# EAGLE design Voltmeter PCB RTC_f (EAGLE 9.6.2)
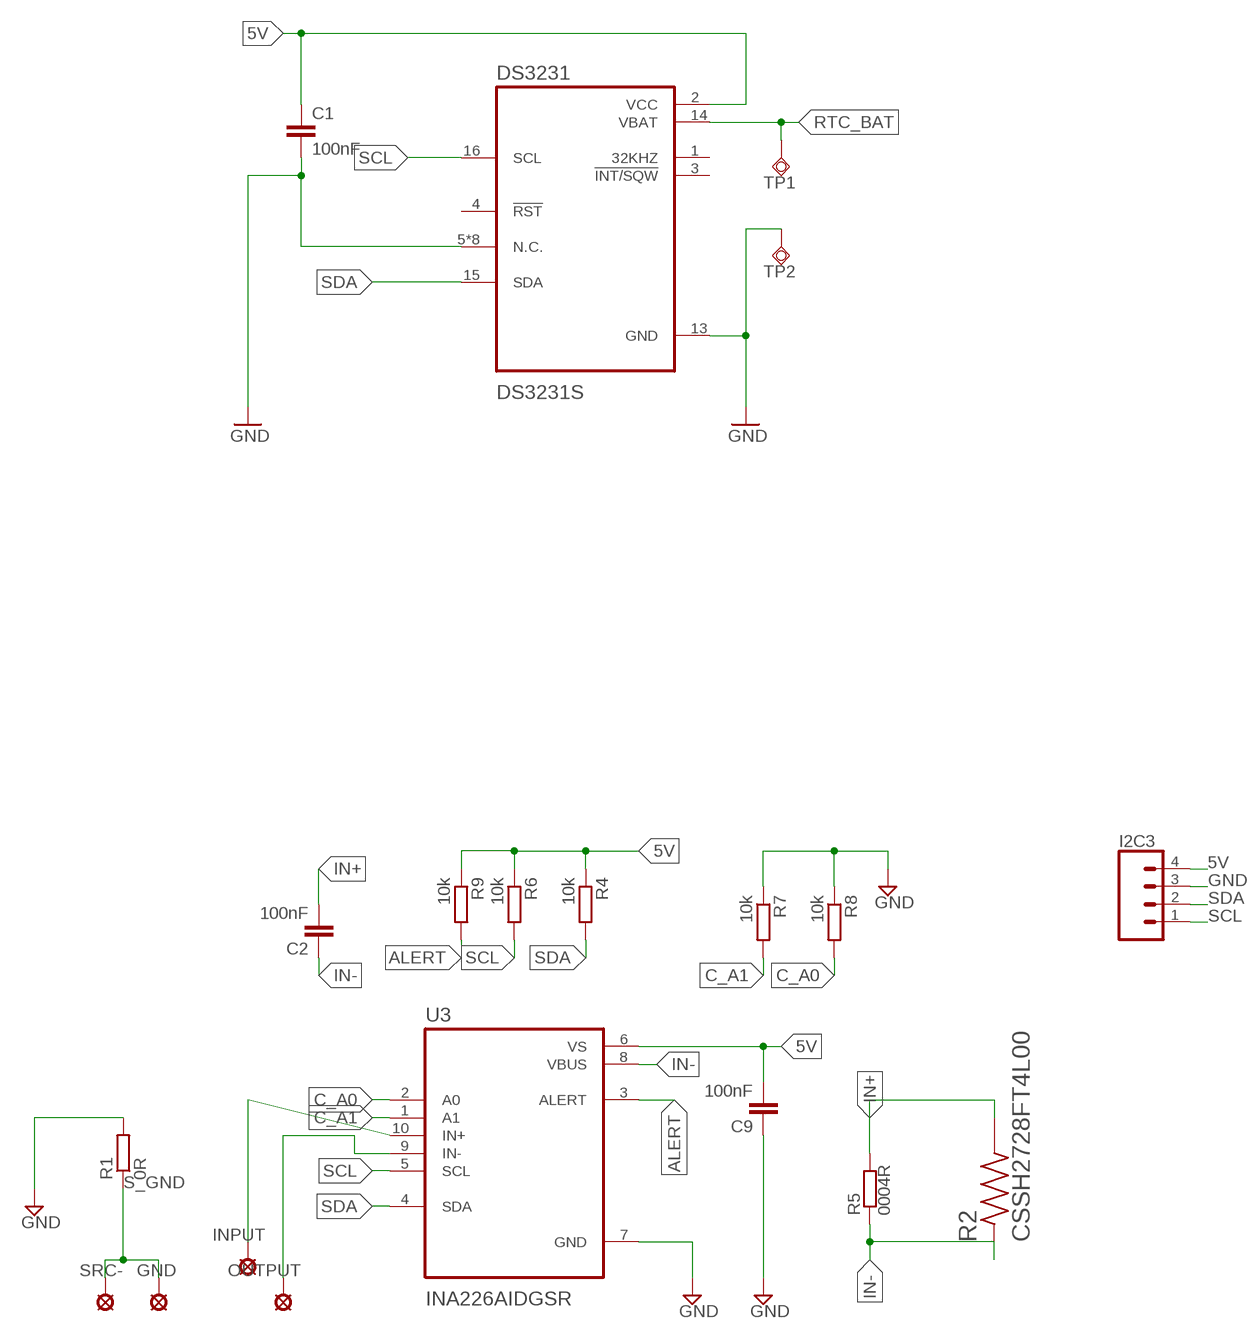
[diagram p0: schematic, sheet 1]

## Parts
C1  100nF  C-EUC0603  [C0603]
C2  100nF  C-EUC0603  [C0603]
C9  100nF  C-EUC0603  [C0603]
DS3231  DS3231S  [SOIC127P1032X265-16N]
GND  SE14  [SE14]
I2C3  CONN_041X04_NO_SILK  [1X04_NO_SILK]
INPUT  SE14  [SE14]
OUTPUT  SE14  [SE14]
R1  0R  R-EU_R1206  [R1206]
R2  CSSH2728FT4L00  [RESC6771X124N]
R4  10k  R-EU_R0603  [R0603]
R5  0004R  BVS  [BVS]
R6  10k  R-EU_R0603  [R0603]
R7  10k  R-EU_R0603  [R0603]
R8  10k  R-EU_R0603  [R0603]
R9  10k  R-EU_R0603  [R0603]
SRC-  SE14  [SE14]
TP1  TPSQB1,27  [B1,27]
TP2  TPSQB1,27  [B1,27]
U3  INA226AIDGSR  [SOP50P490X110-10N]

## Nets
5V: C1.1 C9.2 DS3231.2(VCC) I2C3.4 R4.1 R6.1 R9.1 U3.6(VS)
ALERT: R9.2 U3.3(ALERT)
C_A0: R8.2 U3.2(A0)
C_A1: R7.2 U3.1(A1)
GND: C1.2 C9.1 DS3231.5(N.C.) DS3231.6(N.C.) DS3231.7(N.C.) DS3231.8(N.C.) DS3231.9(N.C.) DS3231.10(N.C.) DS3231.11(N.C.) DS3231.12(N.C.) DS3231.13(GND) I2C3.3 R1.2 R7.1 R8.1 TP2.TP U3.7(GND)
IN+: C2.2 OUTPUT.MP R2.2 R5.1 U3.9(IN-)
IN-: C2.1 INPUT.MP R2.1 R5.2 U3.8(VBUS) U3.10(IN+)
RTC_BAT [medium]: DS3231.14(VBAT) TP1.TP
S_GND [high_current]: GND.MP R1.1 SRC-.MP
SCL: DS3231.16(SCL) I2C3.1 R6.2 U3.5(SCL)
SDA: DS3231.15(SDA) I2C3.2 R4.2 U3.4(SDA)
Unconnected: DS3231.1(32KHZ) DS3231.3(!INT/SQW) DS3231.4(!RST)

## Library data of the parts
C1 = resistor:C-EU: CAPACITOR, European symbol
C2 C9 = rcl:C-EU: CAPACITOR, European symbol; SPICEPREFIX: C
DS3231 = DS3231S:DS3231S: Check prices <https://pricing.snapeda.com/parts/DS3231S/Maxim%20Integrated/view-part?ref=eda>; AVAILABILITY: Warning; DESCRIPTION: Real Time Clock (RTC) IC Clock/Calendar I²C, 2-Wire Serial 16-SOIC (0.295, 7.50mm Width); MF: Maxim Integrated; MP: DS3231S; PACKAGE: SOIC-16 Maxim Integrated; PRICE: None; PURCHASE-URL: https://pricing.snapeda.com/search/part/DS3231S/?ref=eda
GND INPUT OUTPUT SRC- = solpad:SE14: SOLDER PAD E1553, drill 1,4mm, distributor Buerklin, 07F820
I2C3 = SparkFun-Connectors:CONN_04: Multi connection point. Often used as Generic Header-pin footprint for 0.1 inch spaced/style header connections On any of the 0.1 inch spaced packages, you can populate with these: Break Away Headers - Straight <https://www.sparkfun.com/products/116> (PRT-00116) Break Away Male Headers - Right Angle <https://www.sparkfun.com/products/553> (PRT-00553) Female Headers <https://www.sparkfun.com/products/115> (PRT-00115) Break Away Headers - Machine Pin <https://www.sparkfun.com/products/117> (PRT-00117) Break Away Female Headers - Swiss Machine Pin <https://www.sparkfun.com/products/743> (PRT-00743) For SCREWTERMINALS and SPRING TERMINALS visit here: Screw Terimnals on SparkFun.com <https://www.sparkfun.com/search/results?term=Screw+Terminals> (5mm/3.5mm/2.54mm spacing) This device is also useful as a general connection point to wire up your design to another part of your project. Our various solder wires solder well into these plated through hole pads. Hook-Up Wire - Assortment (Stranded, 22 AWG) <https://www.sparkfun.com/products/11375> (PRT-11375) Hook-Up Wire - Assortment (Solid Core, 22 AWG) <https://www.sparkfun.com/products/11367> (PRT-11367) View the entire wire category on our website here <https://www.sparkfun.com/categories/141> Special notes: Molex polarized connector foot print use with SKU : PRT-08231 with associated crimp pins and housings. 1MM SMD Version SKU: PRT-10208; PROD_ID: CONN-09696
R1 R4 R6-R9 = rcl:R-EU_: RESISTOR, European symbol; SPICEPREFIX: R
R2 = CSSH2728FT4L00:CSSH2728FT4L00: Check availability <https://pricing.snapeda.com/parts/CSSH2728FT4L00/Stackpole%20Electronics%20Inc/view-part?ref=eda>; AVAILABILITY: In Stock; CHECK_PRICES: https://www.snapeda.com/parts/CSSH2728FT4L00/Stackpole+Electronics/view-part/?ref=eda; DESCRIPTION: 4 mOhms ±1% 4W Chip Resistor Wide 2827 (7067 Metric), 2728 Automotive AEC-Q200, Current Sense Metal Element; MF: Stackpole Electronics Inc; MP: CSSH2728FT4L00; PACKAGE: 6771 Stackpole; PRICE: None; SNAPEDA_LINK: https://www.snapeda.com/parts/CSSH2728FT4L00/Stackpole+Electronics/view-part/?ref=snap
R5 = resistor-shunt:BVS: SMD SHUNT RESISTOR; OC_FARNELL: unknown; OC_NEWARK: unknown
TP1 TP2 = testpad:TPSQ: Test pad
U3 = INA226AIDGSR:INA226AIDGSR: Check availability <https://pricing.snapeda.com/parts/INA226AIDGSR/Texas%20Instruments/view-part?ref=eda>; AVAILABILITY: In Stock; CHECK_PRICES: https://www.snapeda.com/parts/INA226AIDGSR/Texas+Instruments/view-part/?ref=eda; DESCRIPTION: 36V, 16-bit, ultra-precise i2c output current/voltage/power monitor w/alert; MF: Texas Instruments; MP: INA226AIDGSR; PACKAGE: VSSOP-10 Texas Instruments; PRICE: None; SNAPEDA_LINK: https://www.snapeda.com/parts/INA226AIDGSR/Texas+Instruments/view-part/?ref=snap

## Net classes
0 default: width 0.305 mm, drill 0.254 mm, clearance 0.381 mm
1 high_current: width 3 mm, drill 0.508 mm, clearance 0.9 mm
2 medium: width 0.381 mm, drill 0.3 mm, clearance 0.381 mm

## Board
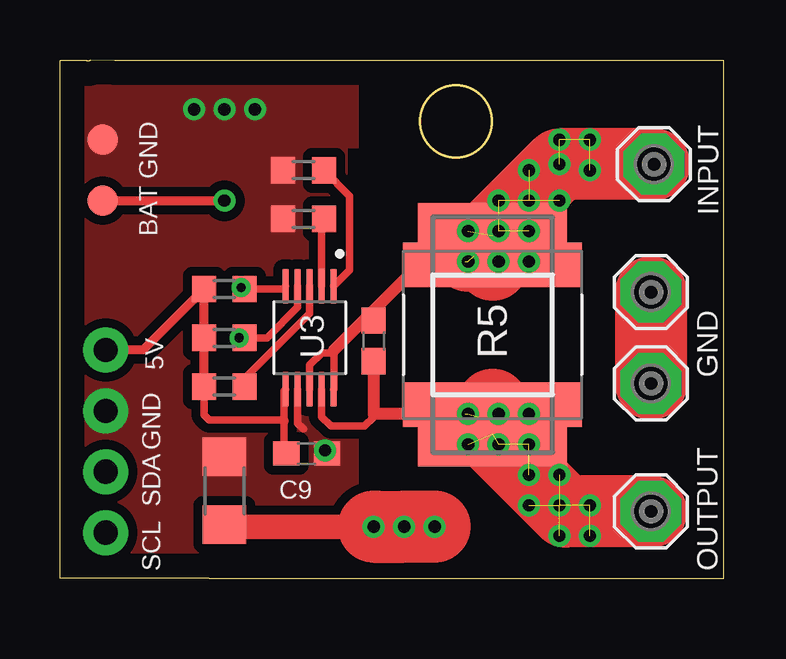
[diagram p1: board, top side]
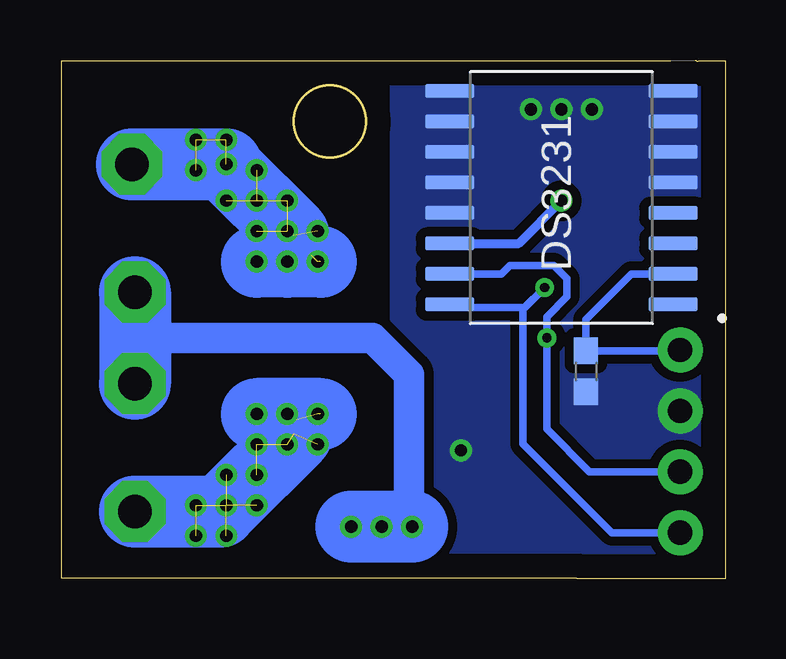
[diagram p2: board, bottom side, seen from below]

Size 27.69 x 21.62 mm. Coordinates in mm from the lower left corner, seen from the top.
Outline: 6.22,0 27.69,0 27.69,21.59 2.29,21.59 1.27,21.62 arc-100 1.11,21.59 0,21.59 0,0 6.16,0 arc-90 6.22,0
Outline: circle at 16.51,19.05 radius 1.5
Copper layers (1*16): Top 0.035mm / dielectric 1.5mm / Bottom 0.035mm
Design rules "default *": minimum track width 10mil, minimum drill 0.35mm, track to track 9mil, track to pad 9mil, pad to pad 6mil, via to via 6mil, smd to smd 6mil, copper to edge 40mil, drill to drill 6mil, minimum pad ring 10mil, minimum via ring 8mil, stop-mask expansion 4mil, vias tented up to drill 100mil, thermal gap 10mil

### Footprints (pad centres in the part's own frame; a part is rotated, then mirrored left to right if it is on the bottom)
C0603 = smd 1.1 x 1: 1 -0.85,0; 2 0.85,0
SOIC127P1032X265-16N = smd 2.05 x 0.59: 1 -4.655,4.445; 2 -4.655,3.175; 3 -4.655,1.905; 4 -4.655,0.635; 5 -4.655,-0.635; 6 -4.655,-1.905; 7 -4.655,-3.175; 8 -4.655,-4.445; 9 4.655,-4.445; 10 4.655,-3.175; 11 4.655,-1.905; 12 4.655,-0.635; 13 4.655,0.635; 14 4.655,1.905; 15 4.655,3.175; 16 4.655,4.445
SE14 = drill 1.397 pad 2.54 octagon: MP 0,0
1X04_NO_SILK = drill 1.016 pad 1.88: 1 0,0; 2 2.54,0; 3 5.08,0; 4 7.62,0
R1206 = smd 1.6 x 1.803: 1 -1.422,0; 2 1.422,0
RESC6771X124N = smd 1.84 x 7.45: 1 -2.916,0; 2 2.916,0
R0603 = smd 1 x 1.1: 1 -0.85,0; 2 0.85,0
BVS = smd 2.7 x 6.2: 1 -4.14,0; 2 4.14,0
B1,27 = smd 1.27 x 1.27: TP 0,0
SOP50P490X110-10N = smd 1.47 x 0.28: 1 -2.15,1; 2 -2.15,0.5; 3 -2.15,0; 4 -2.15,-0.5; 5 -2.15,-1; 6 2.15,-1; 7 2.15,-0.5; 8 2.15,0; 9 2.15,0.5; 10 2.15,1

### Placement (x,y rotation side)
C1  5.84,8.64 270 bottom
C2  13.08,9.91 270 top
C9  10.29,5.21 180 top
DS3231  6.86,15.88 180 bottom
GND  24.64,11.94 0 top
I2C3  1.9,1.91 90 top
INPUT  24.77,17.27 0 top
OUTPUT  24.64,2.79 0 top
R1  6.86,3.66 90 top
R2  18.03,10.16 270 top
R4  6.86,10.03 0 top
R5  18.03,10.16 90 top
R6  6.86,12.07 0 top
R7  10.16,17.02 0 top
R8  10.16,14.99 0 top
R9  6.86,8 0 top
SRC-  24.64,8.13 0 top
TP1  1.78,15.75 0 top
TP2  1.78,18.29 0 top
U3  10.41,10.03 270 top

### Tracks (layer width: path | path; a pad name or v marks a point on that pad's centre or on a via)
5V
  Top 0.305: 9.41,5.41 C9.2 | R9.1 6.01,6.82 6.22,6.6 9.35,6.6 | 9.38,6.57 9.35,6.6 | 9.41,5.53 9.41,5.23 C9.2 | 9.35,6.6 9.35,5.29 C9.2 | U3.6 9.35,7.82 9.35,6.6
  Top 0.381: I2C3.4 3.47,9.53 R6.1 R4.1 R9.1
  Bottom 0.305: DS3231.2 3.94,12.7 5.84,10.8 C1.1 1.94,9.49 I2C3.4
ALERT
  Top 0.305: U3.3 10.41,11.05 7.71,8.34 R9.2
C_A0
  Top 0.305: U3.2 10.91,14.89 R8.2
C_A1
  Top 0.305: R7.2 12.08,15.95 12.08,12.85 U3.1
GND  (via drill 0.51)
  Top 0.305: U3.7 9.91,6.47 10.16,6.22
  other vias: 11.05,5.33 6.86,19.56 8.13,19.56 5.59,19.56
  pour Top (no thermals): -5.84,30.99 11.94,30.99 11.94,-3.3 -5.84,-3.3
  pour Bottom (no thermals): 10.67,29.72 10.67,12.3 3.56,7.22 3.56,3.05 27.18,3.05 27.18,-43.94 -5.84,-43.94 -5.84,29.72
  pour Top (no thermals): -0.76,24.13 11.94,24.13 11.94,-5.84 -0.76,-5.84
  pour Bottom (no thermals): 13.97,32.26 13.97,-1.4 27.18,-1.4 27.18,-43.94 -4.57,-43.94 -4.57,32.26
IN+  (via drill 0.51)  (11 unrouted)
  Top 0.305: U3.9 10.91,6.74 11.3,6.35 12.7,6.35 13.06,6.72 13.06,8.13 | 13.06,8.13 13.06,9.25 12.95,9.14 | C2.2 13.08,8.14 13.06,8.13
  Top 0.508: v18.29,6.86 13.08,6.86 C2.2
  Top 3: OUTPUT.MP 21.08,2.79 18.03,5.84 R5.1 | R5.1 18.03,6.6 v18.29,6.86 | R2.2 R5.1
  Bottom 3: OUTPUT.MP 21.08,2.79 v20.83,3.05 17.91,5.97 17.91,6.62 | 16.89,6.86 v19.56,6.86
  other vias: 17.02,6.86 17.02,5.59 18.29,5.59 19.56,5.59 19.56,4.32 20.83,4.32 22.1,3.05 22.1,1.78 20.83,1.78 19.56,3.05
IN-  (via drill 0.51)  (11 unrouted)
  Top 0.305: 11.43,9.53 11.43,9.4 | U3.8 10.41,8.89 10.92,9.4 11.43,9.4 | C2.1 12.89,10.95 12.89,10.98 | U3.10 11.43,7.9 11.43,9.4
  Top 0.381: 15.37,13.46 17.02,13.46 17.27,13.46
  Top 0.508: 15.37,13.46 12.89,10.98 11.43,9.53
  Top 3: INPUT.MP v20.83,17.27 17.91,14.35 | 17.91,14.35 17.91,13.72 | R2.1 18.03,14.22 17.91,14.35 | R5.2 R2.1 | R2.1 17.65,13.46 17.02,13.46
  Bottom 3: INPUT.MP v20.83,17.27 20.83,17.15 18.03,14.35 18.16,14.35 v18.29,14.48 v18.29,13.21 | 16.89,13.21 v19.56,13.21
  other vias: 17.02,13.21 17.02,14.48 19.56,14.48 22.1,17.02 19.56,17.02 18.29,15.75 19.56,15.75 20.83,18.29 22.1,18.29 20.83,15.75
RTC_BAT  (via drill 0.51)
  Top 0.381: TP1.TP v6.86,15.75
  Bottom 0.381: DS3231.14 8.64,13.97 v6.86,15.75
S_GND  (via drill 0.51)
  Top 1.016: R1.1 6.94,2.16 v13.08,2.16 | v14.35,2.16 13.21,2.16
  Top 3: GND.MP SRC-.MP | v15.62,2.16 v14.35,2.16 v13.08,2.16 13.21,2.16
  Bottom 1.016: SRC-.MP 24,7.49
  Bottom 1.27: SRC-.MP 24.64,9.65 24.26,10.03 14.73,10.03 13.21,8.51 13.21,2.29 v13.08,2.16
  Bottom 3: GND.MP SRC-.MP | v13.08,2.16 v15.62,2.16
SCL  (via drill 0.38)
  Top 0.305: R6.2 7.83,12.18 | R6.2 7.62,12.07 v7.56,12.13 | U3.5 9.3,12.07 R6.2
  Bottom 0.305: I2C3.1 4.75,1.91 8.46,5.61 8.46,11.23 v7.56,12.13 8.38,11.3 11.39,11.3 DS3231.16
SDA  (via drill 0.38)
  Top 0.305: v7.47,10.03 R4.2 8.64,10.03 9.91,11.31 U3.4
  Bottom 0.305: I2C3.2 5.69,4.45 7.47,6.22 v7.47,10.03 | v7.47,10.03 7.62,10.03 | DS3231.15 9.35,12.7 9,13.06 7.17,13.06 6.63,12.51 6.63,11.74 7.47,10.91 v7.47,10.03

### Text on the board
tNames: GND | BAT | 5V | GND | SDA | SCL
bNames: PB-PCB1 V2 5V